# EAGLE schematic 16to4_Decoder (EAGLE 7.7.0)
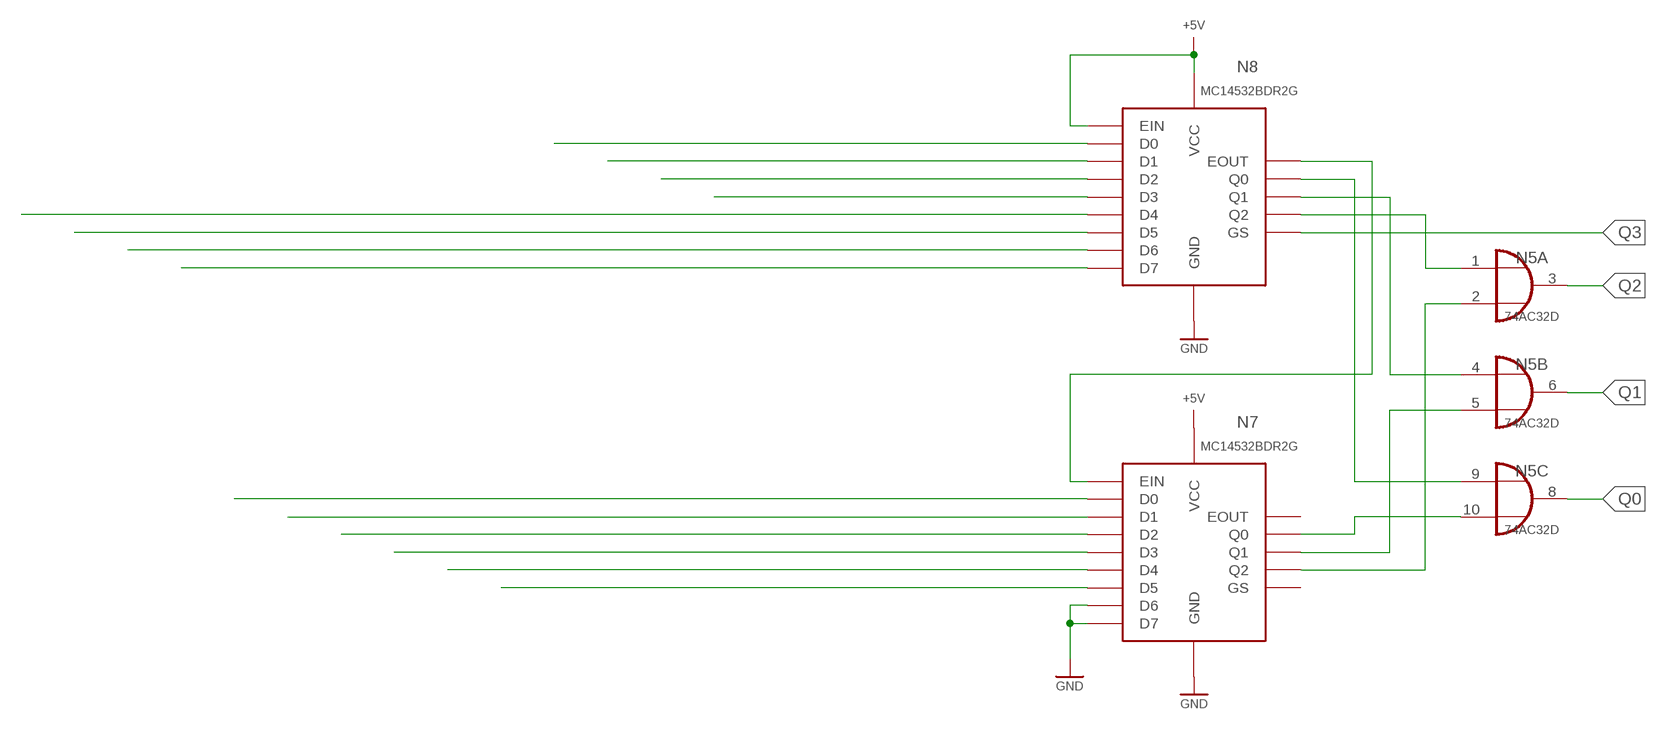
[diagram p0: schematic, sheet 1]

## Parts
N5  74AC32D  [SO14]
N7  MC14532BDR2G  [SOIC16]
N8  MC14532BDR2G  [SOIC16]

## Nets
+5V: N7.16(VCC) N8.5(EIN) N8.16(VCC)
GND: N7.3(D6) N7.4(D7) N7.8(GND) N8.8(GND)
N$1: N8.1(D4)
N$2: N8.2(D5)
N$3: N8.3(D6)
N$4: N8.4(D7)
N$5: N7.10(D0)
N$6: N7.11(D1)
N$7: N7.12(D2)
N$8: N7.13(D3)
N$14: N7.1(D4)
N$15: N7.2(D5)
N$16: N8.10(D0)
N$17: N8.11(D1)
N$18: N8.12(D2)
N$19: N8.13(D3)
N$28: N7.5(EIN) N8.15(EOUT)
N$34: N5.9(C:I0) N8.9(Q0)
N$35: N5.10(C:I1) N7.9(Q0)
N$36: N5.5(B:I1) N7.7(Q1)
N$37: N5.4(B:I0) N8.7(Q1)
N$38: N5.2(A:I1) N7.6(Q2)
N$39: N5.1(A:I0) N8.6(Q2)
Q0: N5.8(C:O)
Q1: N5.6(B:O)
Q2: N5.3(A:O)
Q3: N8.14(GS)
Unconnected: N5.11(D:O) N5.12(D:I0) N5.13(D:I1) N7.14(GS) N7.15(EOUT)

## Power pins joined to a net without a drawn wire
GND: N5.7(P:GND)
VCC: N5.14(P:VCC)

## Library data of the parts
N5 = 74xx-eu:74*32: Quad 2-input OR gate
N7 N8 = ic-logik_HipL:MC14532BDR2G